# EasyEDA Pro project pcb.epro

# Schematic Schematic1
Board Name: Board1; Create Date: 2026-03-26; Page Name: P1; Project Name: SPEAKER; Schematic Name: Schematic1; Update Date: 2026-03-26; Company: EasyEDA.com; Page Size: A4; Version: V1.0
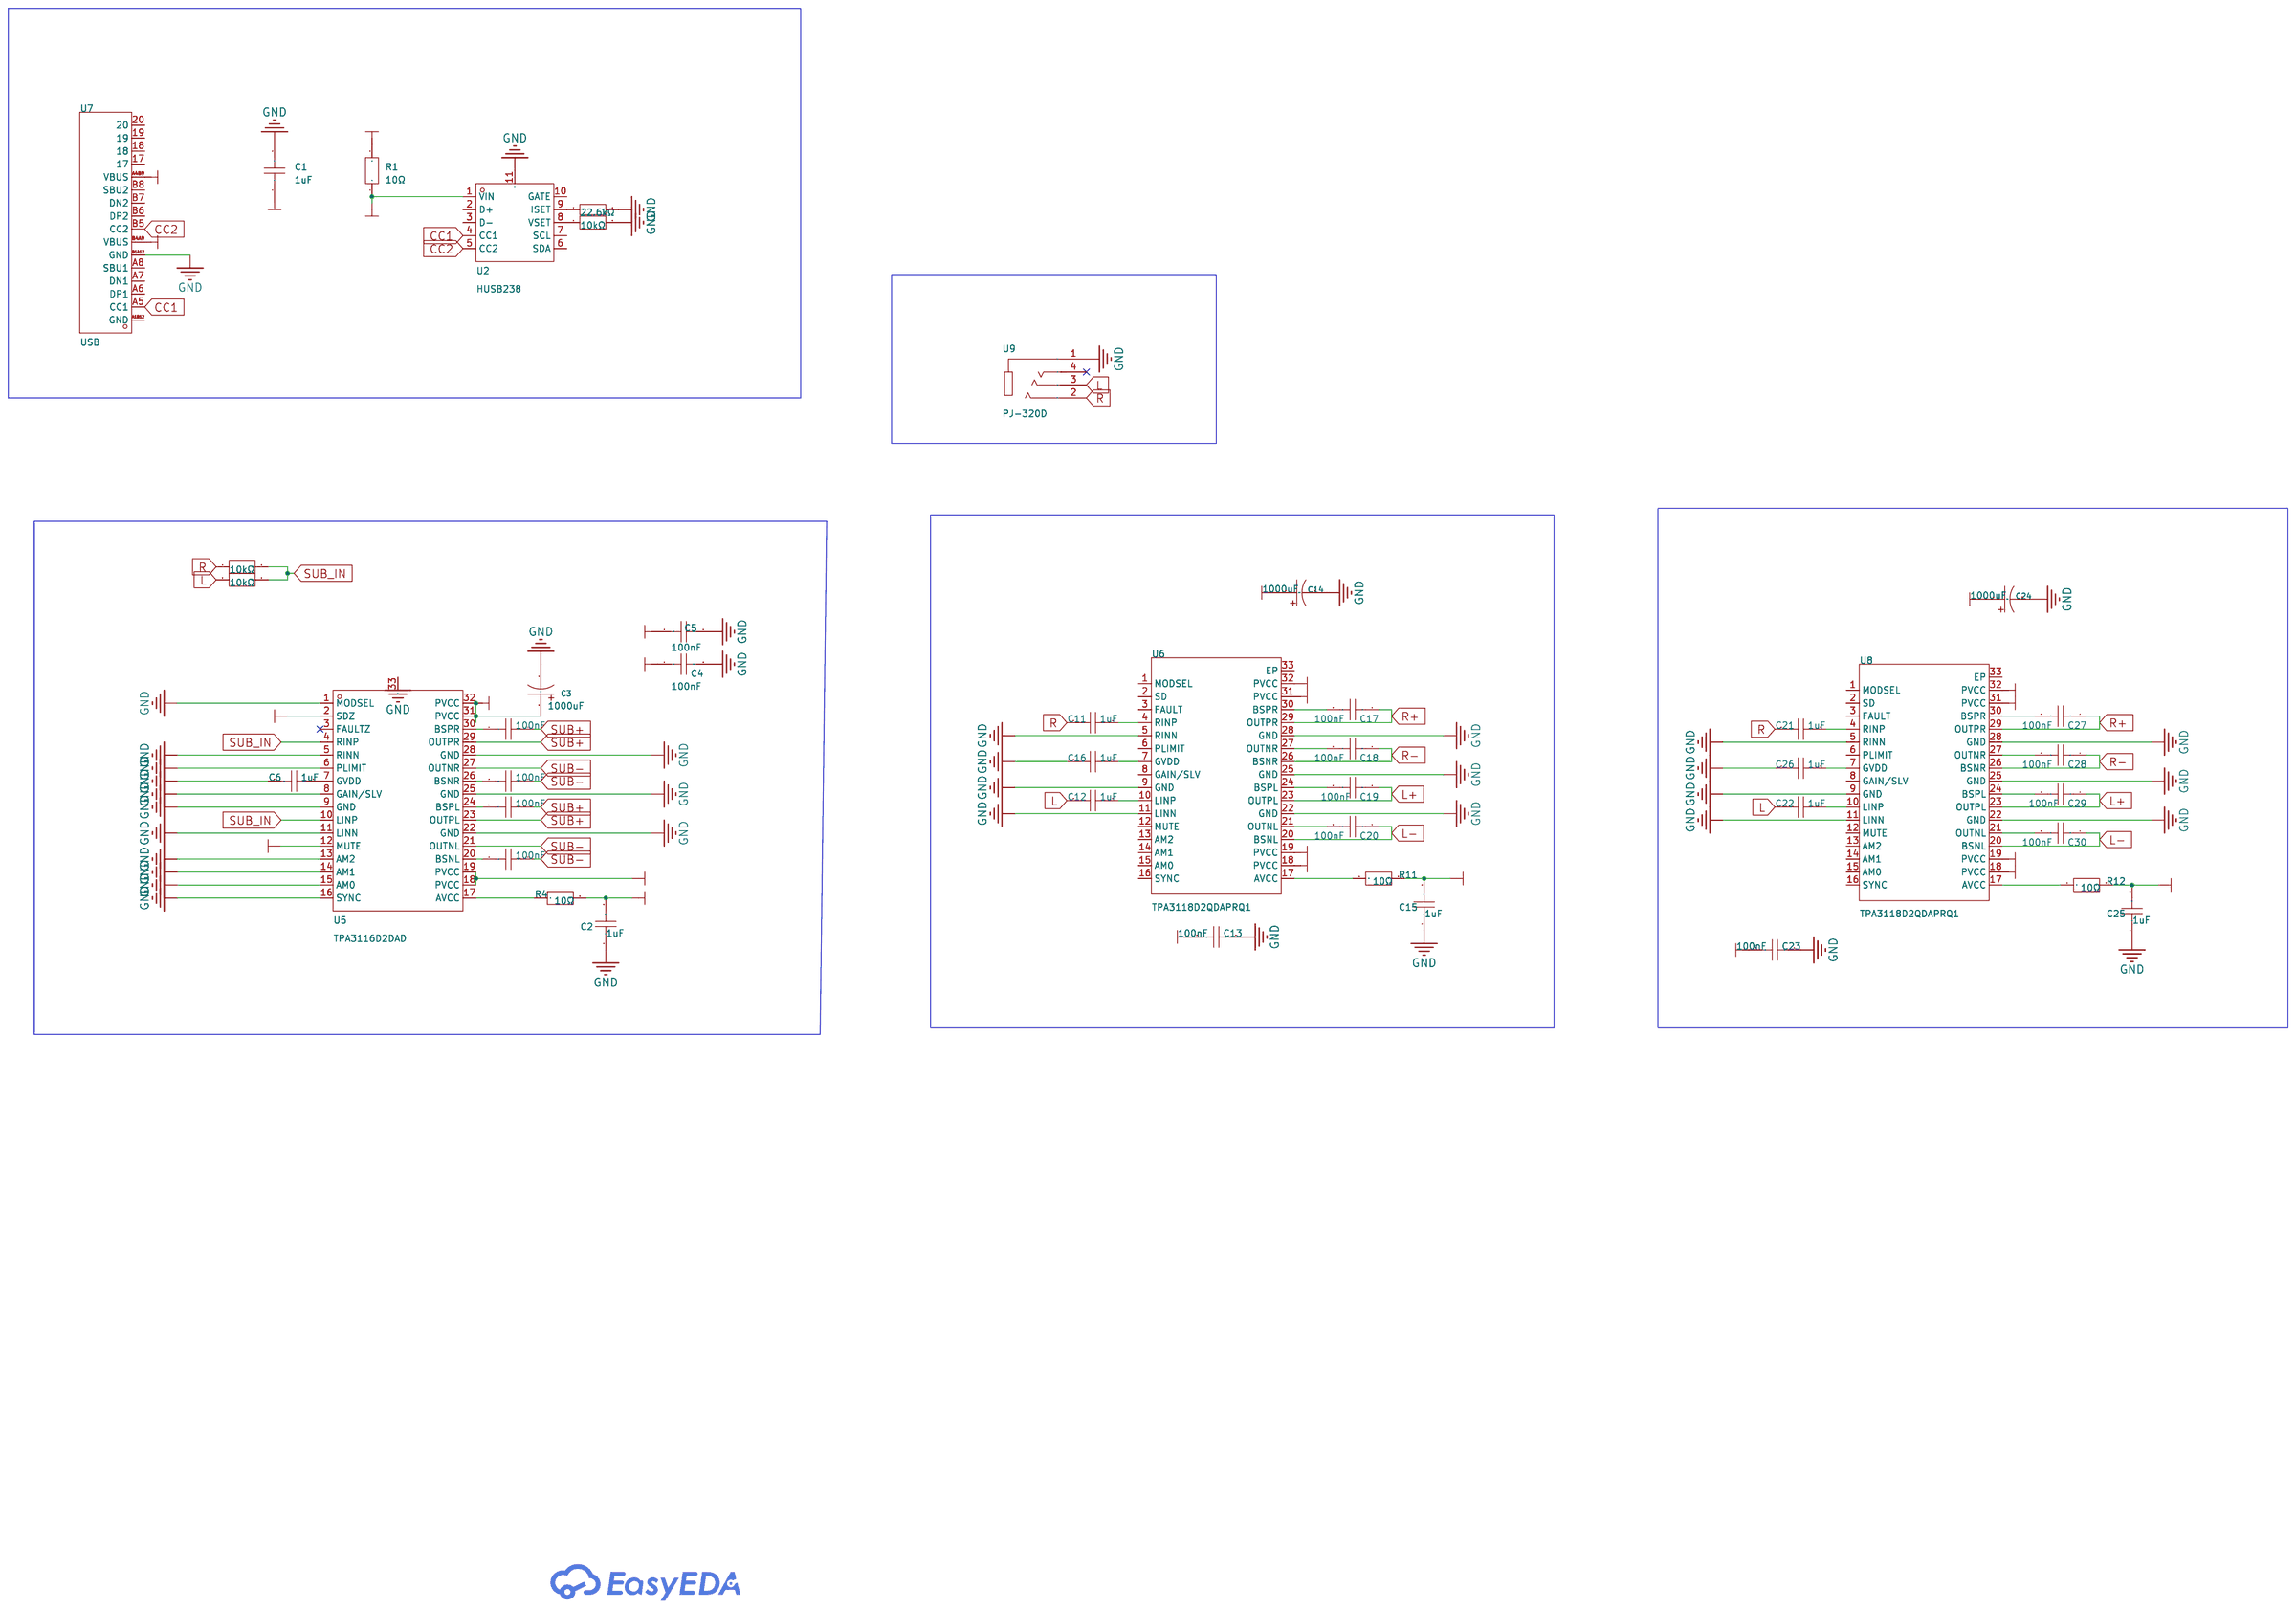
[diagram p0: schematic sheet]

## Parts
C1  1uF  [C0805]
C2  1uF  [C0805]
C3  1000uF  [CAP-TH_BD12.5-P5.00-D0.6-FD]
C4  100nF  [C0603]
C5  100nF  [C0603]
C6  1uF  [C0805]
C7  100nF  [C0603]
C8  100nF  [C0603]
C9  100nF  [C0603]
C10  100nF  [C0603]
C11  1uF  [C0805]
C12  1uF  [C0805]
C13  100nF  [C0603]
C14  1000uF  [CAP-TH_BD12.5-P5.00-D0.6-FD]
C15  1uF  [C0805]
C16  1uF  [C0805]
C17  100nF  [C0603]
C18  100nF  [C0603]
C19  100nF  [C0603]
C20  100nF  [C0603]
C21  1uF  [C0805]
C22  1uF  [C0805]
C23  100nF  [C0603]
C24  1000uF  [CAP-TH_BD12.5-P5.00-D0.6-FD]
C25  1uF  [C0805]
C26  1uF  [C0805]
C27  100nF  [C0603]
C28  100nF  [C0603]
C29  100nF  [C0603]
C30  100nF  [C0603]
R1  10Ω  [R0805]
R2  10kΩ  [R0805]
R3  22.6kΩ  [R0805]
R4  10Ω  [R0805]
R9  10kΩ  [R0805]
R10  10kΩ  [R0805]
R11  10Ω  [R0805]
R12  10Ω  [R0805]
U2  HUSB238  [TDFN-10_L3.0-W3.0-P0.50-TL-EP]
U5  TPA3116D2DAD  [HTSSOP-32_L11.0-W6.1-P0.65-LS8.1-BL]
U6  TPA3118D2QDAPRQ1  [HTSSOP-32_L11.0-W6.1-P0.65-LS8.1-EP3.5_TPA3118D2QDAPRQ1]
U7  USB  [USB-SMD_TYPE-C16PIN-1]
U8  TPA3118D2QDAPRQ1  [HTSSOP-32_L11.0-W6.1-P0.65-LS8.1-EP3.5_TPA3118D2QDAPRQ1]
U9  PJ-320D  [AUDIO-SMD_HANELECTRICITY_PJ-320D]

## Library data of the parts
C1 C2 C6 C11 C12 C15 C16 C21 C22 C25 C26 = LMK212BJ105KG-T: Capacitance: Tolerance:±10% Tolerance:±10% Voltage Rating: Temperature Coefficient:; LCSC Part Name: 1uF ±10% 10V; Supplier Part: C3878898; Manufacturer: TAIYO YUDEN(太诱); Supplier Footprint: 0805; JLCPCB Part Class: Extended Part; Datasheet: https://atta.szlcsc.com/upload/public/pdf/source/20210525/C2802164_C0429B055888A674C3F00BA74B841C5B.pdf; Supplier: LCSC; Tolerance: ±10%
C3 C14 C24 = ECR1HBK102MLL125025: Capacitance:1000uF Tolerance:±20% Tolerance:±20% Voltage Rating:50V Pin Spacing:5mm Diameter:- Height - Seated (Max):- Lifetime:2000hrs@105℃; LCSC Part Name: 1000uF ±20% 50V; Supplier Part: C233103; Manufacturer: Jianghai(南通江海); Supplier Footprint: 插件; JLCPCB Part Class: Extended Part; Supplier: LCSC; Tolerance: ±20%; Voltage Rating: 50V; Pin Spacing: 5mm; Lifetime: 2000hrs@105℃
C4 C5 C7-C10 C13 C17-C20 C23 C27-C30 = CC0603KRX7R9BB104: Capacitance:100nF Tolerance:±10% Tolerance:±10% Voltage Rating:50V Temperature Coefficient:X7R; LCSC Part Name: 100nF ±10% 50V; Supplier Part: C14663; Manufacturer: YAGEO(国巨); Supplier Footprint: 0603; JLCPCB Part Class: Basic Part; Datasheet: https://item.szlcsc.com/datasheet/CC0603KRX7R9BB104/15331.html; Supplier: LCSC; Tolerance: ±10%; Voltage Rating: 50V; Temperature Coefficient: X7R
R1 R4 R11 R12 = MMV05F10R0E: Resistance:10Ω Tolerance:±1% Tolerance:±1% Power(Watts):125mW Temperature Coefficient:±100ppm/℃ Temperature Coefficient:±100ppm/℃ Operating Temperature:-55℃~+155℃ Operating Temperature:-55℃~+155℃; LCSC Part Name: 10Ω ±1% 125mW; Supplier Part: C5675088; Manufacturer: Ohmite; Supplier Footprint: 0805; JLCPCB Part Class: Extended Part; Supplier: LCSC; Tolerance: ±1%; Power(Watts): 125mW; Temperature Coefficient: ±100ppm/℃; Operating Temperature: -55℃~+155℃
R2 R9 R10 = RK73H2ATTE1002F: Resistance:10kΩ Tolerance:±1% Tolerance:±1%; LCSC Part Name: 10kΩ ±1%; Supplier Part: C7050396; Manufacturer: KOA; Supplier Footprint: 0805; JLCPCB Part Class: Extended Part; Datasheet: https://atta.szlcsc.com/upload/public/pdf/source/20240311/4A4D64C25C05C7F668F1C9BDA7CA7852.pdf; Supplier: LCSC; Tolerance: ±1%
R3 = 0805W8F2262T5E: Type:Thick Film Resistors Resistance:22600Ω Tolerance:±1% Tolerance:±1% Power(Watts): Overload Voltage (Max): Operating Temperature Range:-55℃~+155℃ Operating Temperature Range:-55℃~+155℃; LCSC Part Name: 22.6kΩ ±1% 125mW 厚膜电阻; Supplier Part: C17554; Supplier Footprint: 0805; JLCPCB Part Class: Extended Part; Supplier: LCSC; Type: Thick Film Resistors; Tolerance: ±1%; Operating Temperature Range: -55℃~+155℃
U2 = HUSB238: Supplier Part: C9900042462; Supplier Footprint: DFN-10L; Supplier: LCSC
U5 = TPA3116D2DAD: Class:Class D Speaker Channels:2-Channel Output Power:50W×2@4Ω Total Harmonic Distortion + Noise (THD+N):0.1% Quiescent Current:35mA Signal-to-Noise Ratio:102dB Power Supply Rejection Ratio (PSRR):-70dB Efficiency:90% Number of Inputs:- Features:Filterles; LCSC Part Name: 具有AM抑制功能的15W、30W、50W无滤波器D类立体声放大器系列; Supplier Part: C2865736; Manufacturer: TI(德州仪器); Supplier Footprint: HTSSOP-32-EP-6.1mm; JLCPCB Part Class: Extended Part; Datasheet: https://www.ti.com/cn/lit/gpn/tpa3118d2; Supplier: LCSC; Class: Class D; Speaker Channels: 2-Channel; Output Power: 50W×2@4Ω; Total Harmonic Distortion + Noise (THD+N): 0.1%; Quiescent Current: 35mA; Signal-to-Noise Ratio: 102dB; Power Supply Rejection Ratio (PSRR): -70dB; Efficiency: 90%; Features: Filterless architecture；Integrated PLL；Overvoltage protection；Configurable output topology; Voltage - Supply: 4.5V~26V; Operating Temperature: -40℃~+85℃
U6 U8 = TPA3118D2QDAPRQ1: Class:Class D Speaker Channels:2-Channel Output Power:30Wx2@8Ω Total Harmonic Distortion + Noise (THD+N):- Quiescent Current:20mA Signal-to-Noise Ratio:102dB Power Supply Rejection Ratio (PSRR):-70dB Efficiency:- Number of Inputs:- Features:- Voltage - Su; Supplier Part: C2863787; Manufacturer: TI(德州仪器); Supplier Footprint: HTSSOP-32-EP-6.1mm; JLCPCB Part Class: Extended Part; Datasheet: https://www.ti.com/cn/lit/gpn/tpa3118d2-q1; Supplier: LCSC; Class: Class D; Speaker Channels: 2-Channel; Output Power: 30Wx2@8Ω; Quiescent Current: 20mA; Signal-to-Noise Ratio: 102dB; Power Supply Rejection Ratio (PSRR): -70dB; Voltage - Supply: 4.5V~26V; Operating Temperature: -40℃~+125℃
U7 = USB_C_Receptacle_HRO_TYPE-C-31-M-12: Supplier Part: C9900015525; Supplier Footprint: USB_C_Receptacle_USB2.0; JLCPCB Part Class: Extended Part; Supplier: LCSC
U9 = PJ-320D_C22459515: Connector Type:3.5mm Headphone Jack Current Rating:500mA Voltage Rating (Max):30V Contact Material:Copper; LCSC Part Name: 3.5mm耳机座; Supplier Part: C22459515; Manufacturer: HanElectricity(瀚源); Supplier Footprint: SMD; JLCPCB Part Class: Extended Part; Datasheet: https://item.szlcsc.com/datasheet/PJ-320D/24136171.html; Supplier: LCSC; Connector Type: 3.5mm Headphone Jack; Current Rating: 500mA; Voltage Rating (Max): 30V; Contact Material: Copper

## Nets
+12V: C2.2 C3.1 C4.2 C5.2 C13.2 C14.1 C15.2 C23.2 C24.1 C25.2 R1.2 R4.2 R11.2 R12.2 U5.2(SDZ) U5.12(MUTE) U5.18(PVCC) U5.19(PVCC) U5.31(PVCC) U5.32(PVCC) U6.18(PVCC) U6.19(PVCC) U6.31(PVCC) U6.32(PVCC) U8.18(PVCC) U8.19(PVCC) U8.31(PVCC) U8.32(PVCC)
GND: C1.2 C2.1 C3.2 C4.1 C5.1 C6.2 C13.1 C14.2 C15.1 C16.2 C23.1 C24.2 C25.1 C26.2 R2.2 R3.2 U2.11(GND) U5.1(MODSEL) U5.5(RINN) U5.6(PLIMIT) U5.8(GAIN/SLV) U5.9(GND) U5.11(LINN) U5.13(AM2) U5.14(AM1) U5.15(AM0) U5.16(SYNC) U5.22(GND) U5.25(GND) U5.28(GND) U5.33(PAD) U6.5(RINN) U6.9(GND) U6.11(LINN) U6.22(GND) U6.25(GND) U6.28(GND) U7.B1A12(GND) U8.5(RINN) U8.9(GND) U8.11(LINN) U8.22(GND) U8.25(GND) U8.28(GND) U9.1
VBUS: C1.1 R1.1 U2.1(VIN) U7.A4B9(VBUS) U7.B4A9(VBUS)
CC1: U2.4(CC1) U7.A5(CC1)
CC2: U2.5(CC2) U7.B5(CC2)
L: C12.2 C22.2 R10.1 U9.3
L+: C19.1 C29.1 U6.23(OUTPL) U8.23(OUTPL)
L-: C20.1 C30.1 U6.20(BSNL) U8.20(BSNL)
R: C11.2 C21.2 R9.1 U9.2
R+: C17.1 C27.1 U6.29(OUTPR) U8.29(OUTPR)
R-: C18.1 C28.1 U6.26(BSNR) U8.26(BSNR)
SUB+: C7.1 C9.1 U5.23(OUTPL) U5.29(OUTPR)
SUB-: C8.1 C10.1 U5.21(OUTNL) U5.27(OUTNR)
SUB_IN: R9.2 R10.2 U5.4(RINP) U5.10(LINP)
$1N1848: R2.1 U2.8(VSET)
$1N1943: R3.1 U2.9(ISET)
$1N2422: R4.1 U5.17(AVCC)
$1N3643: C6.1 U5.7(GVDD)
$1N3809: C7.2 U5.24(BSPL)
$1N3845: C8.2 U5.20(BSNL)
$1N3957: C9.2 U5.30(BSPR)
$1N4055: C10.2 U5.26(BSNR)
$1N5216: C11.1 U6.4(RINP)
$1N5252: C12.1 U6.10(LINP)
$1N5479: R11.1 U6.17(AVCC)
$1N5517: C16.1 U6.7(GVDD)
$1N5606: C17.2 U6.30(BSPR)
$1N5647: C18.2 U6.27(OUTNR)
$1N5688: C19.2 U6.24(BSPL)
$1N5729: C20.2 U6.21(OUTNL)
$1N6687: C29.2 U8.24(BSPL)
$1N6694: C28.2 U8.27(OUTNR)
$1N6696: C27.2 U8.30(BSPR)
$1N6722: C21.1 U8.4(RINP)
$1N6724: C22.1 U8.10(LINP)
$1N6726: C26.1 U8.7(GVDD)
$1N6739: C30.2 U8.21(OUTNL)
$1N6741: R12.1 U8.17(AVCC)

Not connected (* = marked no-connect by the designer): U2 2(D+) 3(D-) 6(SDA) 7(SCL) 10(GATE); U5 3(FAULTZ)*; U6 1(MODSEL) 2(SD) 3(FAULT) 6(PLIMIT) 8(GAIN/SLV) 12(MUTE) 13(AM2) 14(AM1) 15(AM0) 16(SYNC) 33(EP); U7 17 18 19 20 A1B12(GND) A6(DP1) A7(DN1) A8(SBU1) B6(DP2) B7(DN2) B8(SBU2); U8 1(MODSEL) 2(SD) 3(FAULT) 6(PLIMIT) 8(GAIN/SLV) 12(MUTE) 13(AM2) 14(AM1) 15(AM0) 16(SYNC) 33(EP); U9 4*

# Board PCB1
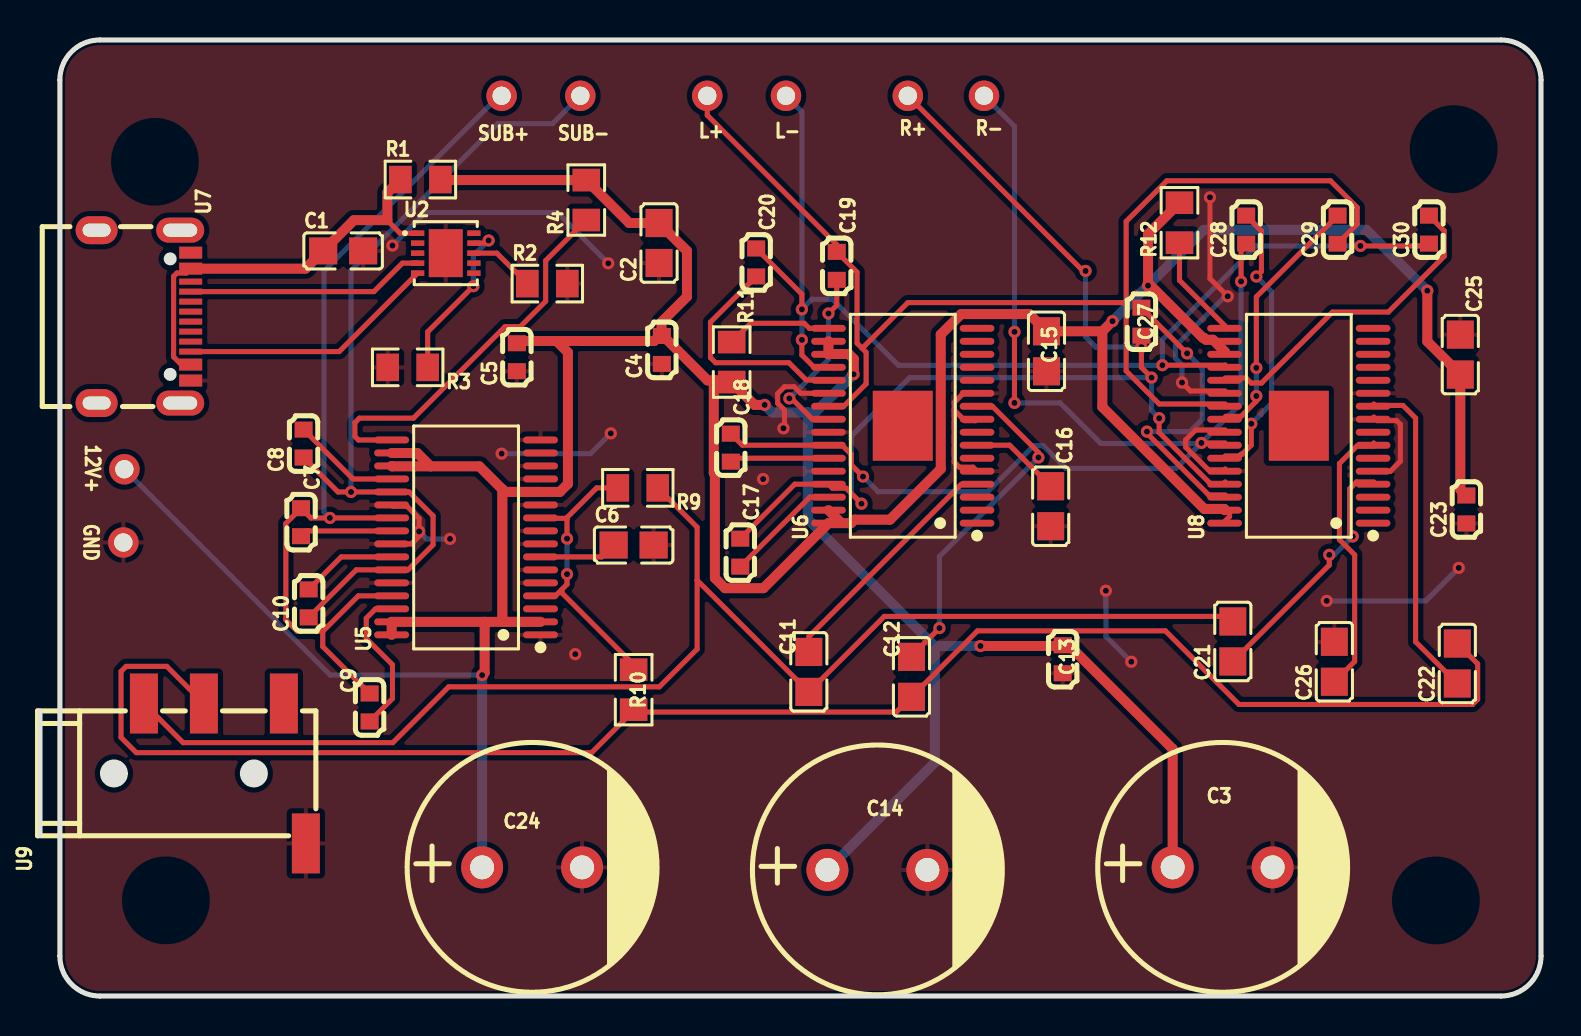
[diagram p1: board, top side]
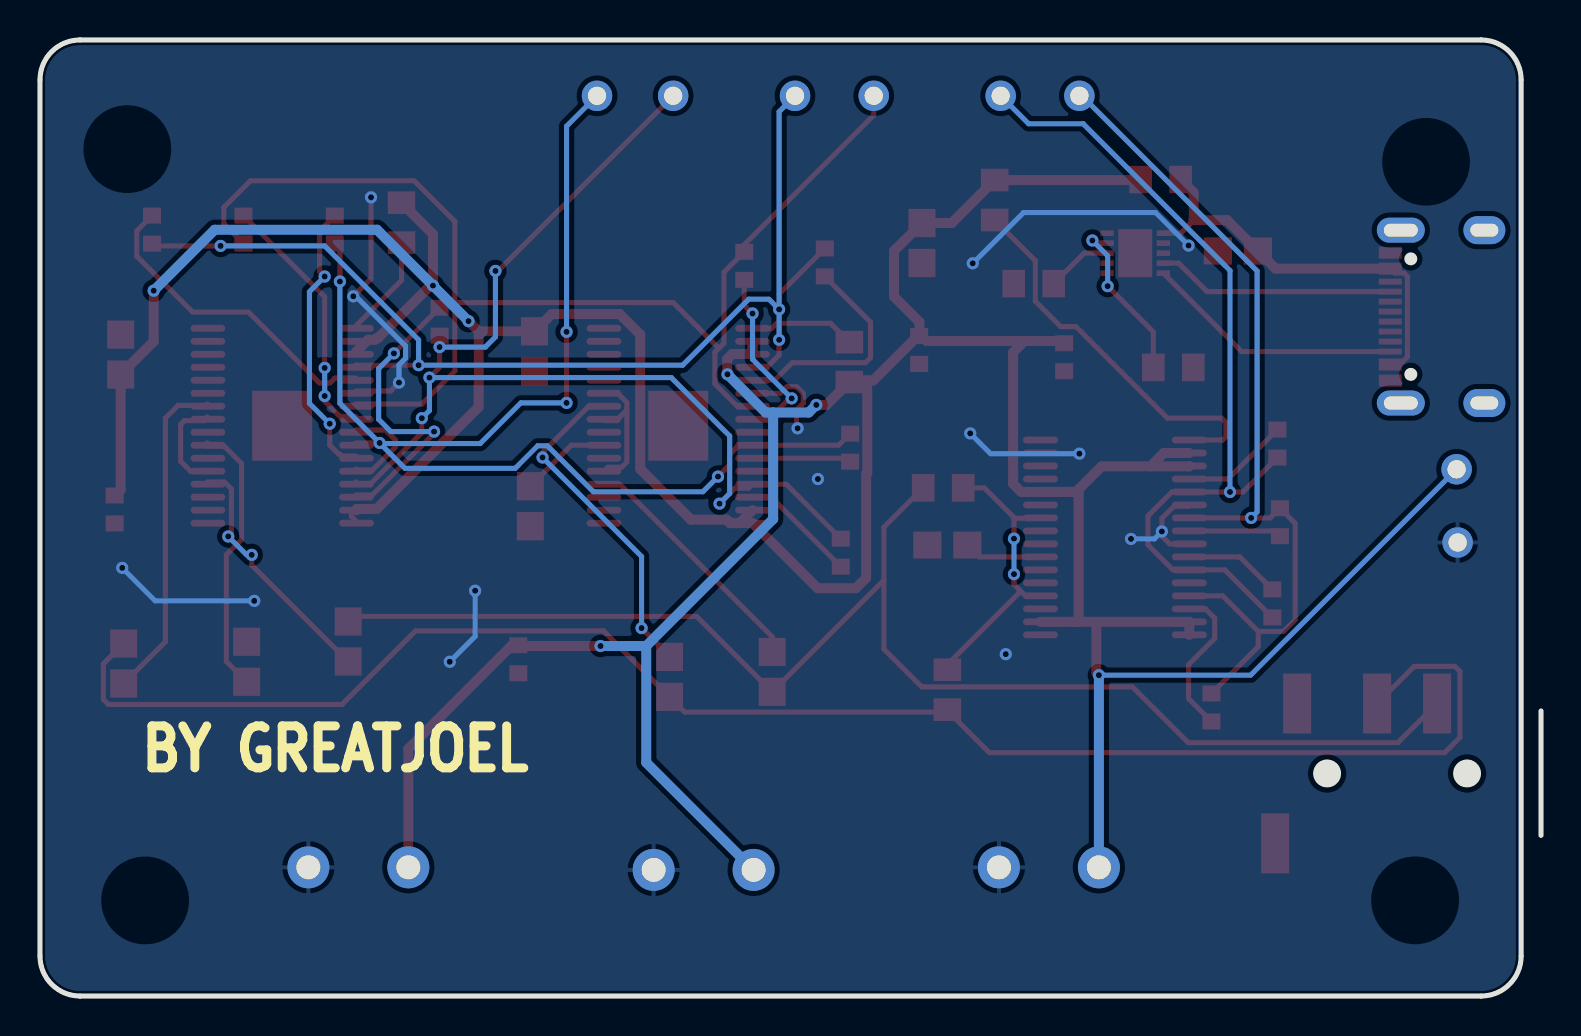
[diagram p2: board, bottom side, seen from below]

Outline 75.09 x 47.84 mm; copper layers: Top Layer, Bottom Layer. Coordinates in mm from the lower left corner of the outline.
Outline path: 1,45.84 1,2 arc(1.58,0.59) 3,0 73.09,0 arc(74.5,0.59) 75.09,2 75.09,45.84 arc(74.5,47.26) 73.09,47.84 3,47.84 arc(1.58,47.26) 1,45.84
Stack: Top Layer 0.035mm / Dielectric1 1.51mm FR4 er 4.5 / Bottom Layer 0.035mm

## Design rules (mm)
template: JLCPCB Capability(Two Layers Board)
spacing copperThickness1oz (default): track to track 0.102, other pairs 0.152 to 0.3
spacing copperThickness2oz: track to track 0.203, other pairs 0.152 to 0.3
track width copperThickness1oz (default): min 0.127, default 0.254, max 2.54
track width copperThickness2oz: min 0.203, default 0.254, max 2.54
differential pair differentialPair (default): width min 0.127, default 0.254, max 2.54; gap min 0.152, default 0.152
via viaSize (default): diameter min 0.5, default 0.61, max 10; hole min 0.3, default 0.305, max 6.3

## Placement (name value [footprint] x y rotation side)
C1  1uF  [C0805]  15.17 37.28 0 top
C2  1uF  [C0805]  30.97 37.68 90 top
C3  1000uF  [CAP-TH_BD12.5-P5.00-D0.6-FD]  59.16 6.44 0 top
C4  100nF  [C0603]  31.11 32.33 90 top
C5  100nF  [C0603]  23.86 31.97 90 top
C6  1uF  [C0805]  29.7 22.57 0 top
C7  100nF  [C0603]  13.06 23.71 270 top
C8  100nF  [C0603]  13.19 27.64 90 top
C9  100nF  [C0603]  16.49 14.44 270 top
C10  100nF  [C0603]  13.44 19.65 90 top
C11  1uF  [C0805]  38.46 16.22 270 top
C12  1uF  [C0805]  43.6 15.97 270 top
C13  100nF  [C0603]  51.16 16.85 90 top
C14  1000uF  [CAP-TH_BD12.5-P5.00-D0.6-FD]  41.89 6.31 0 top
C15  1uF  [C0805]  50.35 32.26 90 top
C16  1uF  [C0805]  50.56 24.51 270 top
C17  100nF  [C0603]  35.03 22.19 270 top
C18  100nF  [C0603]  34.56 27.44 270 top
C19  100nF  [C0603]  39.86 36.54 270 top
C20  100nF  [C0603]  35.83 36.71 270 top
C21  1uF  [C0805]  59.67 17.74 90 top
C22  1uF  [C0805]  70.9 16.64 90 top
C23  100nF  [C0603]  71.35 24.35 90 top
C24  1000uF  [CAP-TH_BD12.5-P5.00-D0.6-FD]  24.62 6.44 0 top
C25  1uF  [C0805]  71.05 32.1 270 top
C26  1uF  [C0805]  64.75 16.73 90 top
C27  100nF  [C0603]  55.1 33.74 90 top
C28  100nF  [C0603]  60.34 38.35 90 top
C29  100nF  [C0603]  64.91 38.35 90 top
C30  100nF  [C0603]  69.48 38.35 90 top
NOREF  -  [Pad_e899]  33.38 45.05 0 top
NOREF#2  -  [Pad_e901]  43.41 45.05 0 top
NOREF#3  -  [Pad_e1148]  4.22 26.36 0 top
NOREF#4  -  [Pad_e902]  47.22 45.05 0 top
NOREF#5  -  [Pad_e898]  27.03 45.05 0 top
NOREF#6  -  [Pad_e897]  23.09 45.05 0 top
NOREF#7  -  [Pad_e900]  37.32 45.05 0 top
NOREF#8  -  [Pad_e1149]  4.17 22.69 0 top
R1  10Ω  [R0805]  19.03 40.86 0 top
R2  10kΩ  [R0805]  25.38 35.65 0 top
R3  22.6kΩ  [R0805]  18.39 31.46 180 top
R4  10Ω  [R0805]  27.33 39.83 90 top
R9  10kΩ  [R0805]  29.9 25.43 180 top
R10  10kΩ  [R0805]  29.7 15.33 90 top
R11  10Ω  [R0805]  34.6 31.72 270 top
R12  10Ω  [R0805]  57 38.7 90 top
U2  HUSB238  [TDFN-10_L3.0-W3.0-P0.50-TL-EP]  20.3 37.17 0 top
U5  TPA3116D2DAD  [HTSSOP-32_L11.0-W6.1-P0.65-LS8.1-BL]  21.32 22.95 90 top
U6  TPA3118D2QDAPRQ1  [HTSSOP-32_L11.0-W6.1-P0.65-LS8.1-EP3.5_TPA3118D2QDAPRQ1]  43.16 28.54 90 top
U7  USB  [USB-SMD_TYPE-C16PIN-1]  5.19 34 270 top
U8  TPA3118D2QDAPRQ1  [HTSSOP-32_L11.0-W6.1-P0.65-LS8.1-EP3.5_TPA3118D2QDAPRQ1]  62.97 28.54 90 top
U9  PJ-320D  [AUDIO-SMD_HANELECTRICITY_PJ-320D]  9.25 11.14 90 top

## Footprints (pads in the part's own frame, mm; a bottom-side part is the same pattern mirrored in y, then rotated)
AUDIO-SMD_HANELECTRICITY_PJ-320D
  rect 3x1.4 smd: 1(-3.5,-4.05) 2(3.5,4.05) 3(3.5,1.05) 4(3.5,-2.95)
C0603
  rect 0.8x0.9 smd: 1(-0.7,0) 2(0.7,0)
C0805
  rect 1.41x1.35 smd: 1(-1,0) 2(1,0)
CAP-TH_BD12.5-P5.00-D0.6-FD
  round 2.1 hole 1.2: 1(-2.5,0) 2(2.5,0)
HTSSOP-32_L11.0-W6.1-P0.65-LS8.1-BL
  oval 0.343x1.746 smd: 1(-4.875,-3.724) 2(-4.225,-3.724) 3(-3.575,-3.724) 4(-2.925,-3.724) 5(-2.275,-3.724) 6(-1.625,-3.724) 7(-0.975,-3.724) 8(-0.325,-3.724) 9(0.325,-3.724) 10(0.975,-3.724) 11(1.625,-3.724) 12(2.275,-3.724) 13(2.925,-3.724) 14(3.575,-3.724) 15(4.225,-3.724) 16(4.875,-3.724) 17(4.875,3.724) 18(4.225,3.724) 19(3.575,3.724) 20(2.925,3.724) 21(2.275,3.724) 22(1.625,3.724) 23(0.975,3.724) 24(0.325,3.724) 25(-0.325,3.724) 26(-0.975,3.724) 27(-1.625,3.724) 28(-2.275,3.724) 29(-2.925,3.724) 30(-3.575,3.724) 31(-4.225,3.724) 32(-4.875,3.724)
HTSSOP-32_L11.0-W6.1-P0.65-LS8.1-EP3.5_TPA3118D2QDAPRQ1
  oval 0.343x1.732 smd: 1(-4.875,-3.716) 2(-4.225,-3.716) 3(-3.575,-3.716) 4(-2.925,-3.716) 5(-2.275,-3.716) 6(-1.625,-3.716) 7(-0.975,-3.716) 8(-0.325,-3.716) 9(0.325,-3.716) 10(0.975,-3.716) 11(1.625,-3.716) 12(2.275,-3.716) 13(2.925,-3.716) 14(3.575,-3.716) 15(4.225,-3.716) 16(4.875,-3.716) 17(4.875,3.716) 18(4.225,3.716) 19(3.575,3.716) 20(2.925,3.716) 21(2.275,3.716) 22(1.625,3.716) 23(0.975,3.716) 24(0.325,3.716) 25(-0.325,3.716) 26(-0.975,3.716) 27(-1.625,3.716) 28(-2.275,3.716) 29(-2.925,3.716) 30(-3.575,3.716) 31(-4.225,3.716) 32(-4.875,3.716)
  rect 3.5x3 smd: 33(0,0)
Pad_e897
  round 1.524 hole 0.914: 1(0,0)
Pad_e898
  round 1.524 hole 0.914: 1(0,0)
Pad_e899
  round 1.524 hole 0.914: 1(0,0)
Pad_e900
  round 1.524 hole 0.914: 1(0,0)
Pad_e901
  round 1.524 hole 0.914: 1(0,0)
Pad_e902
  round 1.524 hole 0.914: 1(0,0)
Pad_e1148
  round 1.524 hole 0.914: 1(0,0)
Pad_e1149
  round 1.524 hole 0.914: 2(0,0)
R0805
  rect 1.133x1.377 smd: 1(-1,0) 2(1,0)
TDFN-10_L3.0-W3.0-P0.50-TL-EP
  rect 0.665x0.28 smd: 1(-1.407,1) 2(-1.407,0.5) 3(-1.407,0) 4(-1.407,-0.5) 5(-1.407,-1) 6(1.407,-1) 7(1.407,-0.5) 8(1.407,0) 9(1.407,0.5) 10(1.407,1)
  rect 1.7x2.4 smd: 11(0,0)
USB-SMD_TYPE-C16PIN-1
  oval 1.25x2.4 hole 0.65x1.7: 17(-4.325,1.827) 18(4.325,1.827)
  oval 1.4x2.1 hole 0.65x1.4: 19(-4.325,-2.353) 20(4.325,-2.353)
  rect 0.6x1.15 smd: A1B12(-3.2,2.353) A4B9(-2.4,2.353) B1A12(3.2,2.353) B4A9(2.4,2.353)
  rect 0.3x1.15 smd: A5(-1.25,2.353) A6(-0.25,2.353) A7(0.25,2.353) A8(1.25,2.353) B5(1.75,2.353) B6(0.75,2.353) B7(-0.75,2.353) B8(-1.75,2.353)

## Nets
+12V: C2.2 C3.1 C4.2 C5.2 C13.2 C14.1 C15.2 C23.2 C24.1 C25.2 NOREF#3.1 R1.2 R4.2 R11.2 R12.2 U5.2 U5.12 U5.18 U5.19 U5.31 U5.32 U6.18 U6.19 U6.31 U6.32 U8.18 U8.19 U8.31 U8.32
GND: C1.2 C2.1 C3.2 C4.1 C5.1 C6.2 C13.1 C14.2 C15.1 C16.2 C23.1 C24.2 C25.1 C26.2 NOREF#8.2 R2.2 R3.2 U2.11 U5.1 U5.5 U5.6 U5.8 U5.9 U5.11 U5.13 U5.14 U5.15 U5.16 U5.22 U5.25 U5.28 U6.5 U6.9 U6.11 U6.22 U6.25 U6.28 U7.B1A12 U8.5 U8.9 U8.11 U8.22 U8.25 U8.28 U9.1
VBUS: C1.1 R1.1 U2.1 U7.A4B9 U7.B4A9
CC1: U2.4 U7.A5
CC2: U2.5 U7.B5
L: C12.2 C22.2 R10.1 U9.3
L+: C19.1 C29.1 NOREF.1 U6.23 U8.23
L-: C20.1 C30.1 NOREF#7.1 U6.20 U8.20
R: C11.2 C21.2 R9.1 U9.2
R+: C17.1 C27.1 NOREF#2.1 U6.29 U8.29
R-: C18.1 C28.1 NOREF#4.1 U6.26 U8.26
SUB+: C7.1 C9.1 NOREF#6.1 U5.23 U5.29
SUB-: C8.1 C10.1 NOREF#5.1 U5.21 U5.27
SUB_IN: R9.2 R10.2 U5.4 U5.10
$1N1848: R2.1 U2.8
$1N1943: R3.1 U2.9
$1N2422: R4.1 U5.17
$1N3643: C6.1 U5.7
$1N3809: C7.2 U5.24
$1N3845: C8.2 U5.20
$1N3957: C9.2 U5.30
$1N4055: C10.2 U5.26
$1N5216: C11.1 U6.4
$1N5252: C12.1 U6.10
$1N5479: R11.1 U6.17
$1N5517: C16.1 U6.7
$1N5606: C17.2 U6.30
$1N5647: C18.2 U6.27
$1N5688: C19.2 U6.24
$1N5729: C20.2 U6.21
$1N6687: C29.2 U8.24
$1N6694: C28.2 U8.27
$1N6696: C27.2 U8.30
$1N6722: C21.1 U8.4
$1N6724: C22.1 U8.10
$1N6726: C26.1 U8.7
$1N6739: C30.2 U8.21
$1N6741: R12.1 U8.17

Pads without a net: U2 2 3 6 7 10; U5 3; U6 1 2 3 6 8 12 13 14 15 16 33; U7 17 18 19 20 A1B12 A6 A7 A8 B6 B7 B8; U8 1 2 3 6 8 12 13 14 15 16 33; U9 4

## Via types
v1: diameter 0.61, hole 0.305, Top Layer to Bottom Layer, 55 vias

## Routing (per net, layer and track width the routed paths; a pad name or vN(x,y) marks a point on that pad's centre or on a via; arc(x,y) is an arc through that point)
+12V: length 250.7
  Top Layer w0.254: 59.33,24.43 59.51,24.25 59.51,23.99 59.29,23.78
  Top Layer w0.5: 23.13,25.36 21.98,26.5 19.54,26.5 ; 22.24,18.72 22.24,16.18 v1(22.12,16.06) ; 22.24,18.72 23.26,18.72 ; 22.24,18.72 U5.31 U5.32 ; 53.14,33.26 v1(53.65,33.77) ; 53.14,33.26 53.14,29.47 58.24,24.37 59.24,24.37 59.26,24.36 59.26,24.31 ; 53.14,33.26 C15.2 49.49,34.12 46.08,34.12 45.06,33.1 45.06,26.38 42.52,23.84 40.74,23.84 40.62,23.71 ; C5.2 23.97,32.78 25.84,32.78 ; R1.2 20.05,40.83 R4.2 29.48,38.68 C2.2 32.36,37.28 32.36,35 31.09,33.73 31.09,33.11 33.4,30.81 33.76,30.81 ; 25.84,32.78 30.73,32.78 30.98,33.03 ; 25.84,32.78 26.41,32.21 26.41,25.63 26,25.22 U5.12 ; v1(47.05,17.52) 51.11,17.52 ; 51.11,17.52 51.51,17.52 56.66,12.37 C3.1 ; 51.11,17.52 C13.2 ; v1(36.25,29.58) 35.74,29.58 R11.2 34.52,30.81 33.76,30.81 ; R12.2 55.43,38.12 v1(55.43,35.55) 55.56,35.55 58.17,32.94 58.22,32.94 58.32,32.84 58.68,32.84 59.29,32.23 ; U5.19 17.61,26.5 19.54,26.5 ; 19.54,26.5 18.87,27.17 U5.18 ; 33.76,30.81 33.7,30.75 33.7,26.17 33.76,26.12 33.76,20.92 34.27,20.41 36.19,20.41 U6.32 40.57,23.66 40.62,23.71 ; C23.2 71.05,25.35 71.05,31.1 69.4,32.75 v1(69.4,35.29) ; 40.62,23.71 40.57,23.71 ; U6.18 U6.19 39.46,32.13 40.46,32.13 40.71,31.87 40.71,31.13 v1(40.7,31.11) ; U6.31 39.99,23.77
  Top Layer w0.508: U5.12 23.26,25.22 23.13,25.36 23.13,18.86 23.26,18.72 U5.2
  Bottom Layer w0.254: v1(22.12,16.06) 14.53,16.06 NOREF#3.1
  Bottom Layer w0.5: 38.41,29.2 36.63,29.2 v1(36.25,29.58) ; 38.41,29.2 38.78,29.2 v1(40.7,31.11) ; 38.41,29.2 38.41,23.86 44.76,17.52 ; 44.76,17.52 44.76,11.68 C14.1 ; 44.76,17.52 v1(47.05,17.52) ; v1(22.12,16.06) C24.1 ; v1(53.65,33.77) v1(55.43,35.55) 58.22,38.34 66.35,38.34 v1(69.4,35.29)
GND: length 70.5
  Top Layer w0.254: U5.25 18.58,22.62 18.97,23.01 18.97,23.9 18.36,24.51 17.66,24.51 U5.22 ; U6.11 46.19,30.16 45.73,29.7 45.73,29.33 ; 45.73,29.33 45.73,26.73 45.99,26.46 46.68,26.46 U6.5 ; 45.73,29.33 46.26,28.79 46.8,28.79 U6.9 ; v1(58.53,39.97) 58.53,35.9 v1(59.42,35.01) ; U6.22 38.06,30.16 37.73,30.49 37.24,30.49 36.9,30.15 36.9,29.66 37.24,29.32 37.24,28.46 v1(37.19,28.41) ; v1(57.13,30.7) 57.55,30.28 59.29,30.28 ; 59.29,28.33 57.81,28.33 57.31,27.83 57.31,27.47 58.45,26.33 59.24,26.33 59.29,26.38 ; 66.72,28.98 66.91,28.79 67.87,28.79 68.05,28.61 68.05,26.76 67.54,26.25 66.72,26.25 66.71,26.26 U8.5
  Bottom Layer w0.254: v1(59.42,35.01) 59.29,35.01 56.8,32.52 56.8,31.92 57.13,31.59 v1(57.13,30.7) ; v1(18.97,23.25) 19.34,22.88 v1(20.51,22.88) ; v1(64.37,19.77) 69.32,19.77 v1(70.97,21.42) ; v1(28.55,28.16) 27.54,27.14 v1(23.09,27.14) ; v1(53.32,20.28) 53.32,18 v1(54.59,16.73) ; v1(28.43,36.66) 25.89,39.2 19.28,39.2 v1(17.63,37.55)
  vias: v1(26.78,17.11) v1(36.17,25.87)
VBUS: length 21.1
  Top Layer w0.254: U7.A4B9 7.32,36.18 6.85,36.18 6.68,36.01 6.68,31.98 7.21,31.46 7.4,31.46 U7.B4A9 ; U2.1 18.01,38.17 17.38,38.81
  Top Layer w0.5: U7.A4B9 13.28,36.4 C1.1 15.7,38.82 17.38,38.82 17.38,40.2 18.03,40.86
CC1: length 11.9
  Top Layer w0.254: U2.4 18.13,36.67 16.7,35.25 U7.A5
CC2: length 13
  Top Layer w0.254: U7.B5 14.97,32.25 U2.5
L: length 84.5
  Top Layer w0.254: 29.88,14.46 27.59,12.18 4.82,12.18 4.06,12.94 4.06,16.24 4.31,16.5 6.34,16.5 U9.3 ; 29.88,14.46 29.73,14.43 29.7,14.58 ; 29.88,14.46 29.88,14.21 42.83,14.21 C12.2 46.9,18.27 56.3,18.27 59.98,14.59 71.66,14.59 71.92,14.84 71.92,16.62 C22.2
L+: length 62.5
  Top Layer w0.254: 41.13,32.41 40.87,32.67 40.87,36.22 C19.1 39.86,37.6 33.38,44.07 NOREF.1 ; 41.13,32.41 43.41,34.7 54.33,34.7 ; 41.13,32.41 41.33,32.21 41.33,30.63 40.2,29.51 39.44,29.51 ; 54.33,34.7 54.33,31.28 55.99,29.63 59.29,29.63 ; 54.33,34.7 54.33,38.76 56.37,40.79 64.56,40.79 65.89,39.46 65.89,38.63 C29.1
L-: length 58.2
  Top Layer w0.254: 59.29,31.58 59.28,31.57 v1(56.15,31.57) ; U6.20 38.73,31.46 38.11,32.07 v1(38.11,32.84) ; v1(66.05,37.53) 69.37,37.53 C30.1 ; C20.1 38.11,35.12 v1(38.11,34.36)
  Bottom Layer w0.254: v1(66.05,37.53) 60.85,37.53 56.15,32.84 v1(56.15,31.57) 42.94,31.57 39.64,34.87 38.62,34.87 v1(38.11,34.36) ; NOREF#7.1 38.11,44.25 v1(38.11,34.36) ; v1(38.11,34.36) v1(38.11,32.84)
R: length 70.1
  Top Layer w0.254: 32.87,20.81 32.87,17.36 30.98,15.47 20.44,15.47 17.65,12.68 7.16,12.68 U9.2 ; 32.87,20.81 C11.2 42.24,19 59.42,19 C21.2 ; 32.87,20.81 32.87,23.46 R9.1
R+: length 55.9
  Top Layer w0.254: C17.1 37.76,25.61 U6.29 39.64,25.41 40.32,25.41 41.09,24.64 v1(41.09,24.64) ; C27.1 v1(55.1,32.47) 55.1,31.45 v1(55.61,30.95) ; 59.29,25.73 59.18,25.62 58.57,25.62 55.99,28.2 v1(55.99,28.91) ; v1(52.3,36.28) 52.18,36.28 NOREF#2.1
  Bottom Layer w0.254: v1(52.3,36.28) 52.3,32.98 52.81,32.47 v1(55.1,32.47) ; v1(55.99,28.91) 55.61,29.29 v1(55.61,30.95) 43.51,30.95 40.59,28.02 40.59,25.15 v1(41.09,24.64)
R-: length 65.3
  Top Layer w0.254: v1(58.1,27.68) 59.29,27.68 ; C18.1 35.14,27.56 U6.26 40.12,27.56 40.59,27.1 40.59,26.57 v1(41.17,25.99) ; C28.1 60.08,37.4 v1(60.08,35.76) ; v1(48.75,29.68) v1(48.75,33.24)
  Bottom Layer w0.254: v1(41.17,25.99) 41.93,25.23 47.41,25.23 49.7,27.53 50.19,27.53 51.32,26.41 56.83,26.41 58.07,27.65 ; 58.07,27.65 53.07,27.65 51.03,29.68 v1(48.75,29.68) ; 58.07,27.65 v1(58.1,27.68) 60.08,29.66 v1(60.08,35.76) ; v1(48.75,33.24) 48.75,43.52 NOREF#4.1
SUB+: length 46
  Top Layer w0.254: C9.1 14.14,17.48 14.14,18.25 ; U5.29 15.92,20.02 14.14,18.25 ; 14.14,18.25 12.88,18.25 12.3,18.82 12.3,23.65 C7.1 13.55,23.92 v1(14.5,23.92) U5.23
  Bottom Layer w0.254: NOREF#6.1 22.97,45.05 14.2,36.28 14.2,24.22 v1(14.5,23.92)
SUB-: length 43
  Top Layer w0.254: C8.1 14.91,25.22 v1(15.56,25.22) U5.21 18.46,25.22 19.66,24.02 19.66,22.58 18.41,21.32 U5.27 15.82,21.32 C10.1
  Bottom Layer w0.254: NOREF#5.1 25.63,43.65 22.9,43.65 15.56,36.31 v1(15.56,25.22)
SUB_IN: length 14.6
  Top Layer w0.254: U5.4 25.79,20.02 26.11,20.35 ; 29.7,16.58 26.11,20.17 26.11,20.35 ; 26.36,23.9 26.36,23.94 27.85,25.43 R9.2 ; 26.36,23.9 25.06,23.9 U5.10 ; 26.36,23.9 v1(26.36,22.89) ; 26.11,20.35 26.36,20.6 v1(26.36,21.11)
  Bottom Layer w0.254: v1(26.36,22.89) v1(26.36,21.11)
$1N1848: length 3.3
  Top Layer w0.254: R2.1 22.86,37.17 U2.8
$1N1943: length 8.4
  Top Layer w0.254: U2.9 22.31,37.67 v1(22.44,37.81) ; v1(21.68,35.52) 19.39,33.24 R3.1
  Bottom Layer w0.254: v1(21.68,35.52) 21.68,37.05 v1(22.44,37.81)
$1N2422: length 19.6
  Top Layer w0.254: R4.1 25.3,36.8 25.3,34.77 24.03,33.5 23.26,33.5 18.69,28.92 15.98,28.92 15.75,28.69 15.75,28 15.93,27.82 U5.17
$1N3643: length 3.9
  Top Layer w0.254: 25.04,21.97 28.1,21.97 C6.1
$1N3809: length 4.6
  Top Layer w0.254: U5.24 13.32,23.27 C7.2
$1N3845: length 5.4
  Top Layer w0.254: C8.2 15.66,25.87 U5.20
$1N3957: length 7.6
  Top Layer w0.254: C9.2 17.63,14.88 17.63,16.58 16.32,17.89 16.32,18.91 16.79,19.37 U5.30
$1N4055: length 4.8
  Top Layer w0.254: 17.59,21.97 15.07,21.97 C10.2
$1N5216: length 12.3
  Top Layer w0.254: C11.1 38.46,17.98 46.08,25.6 46.86,25.6 U6.4
$1N5252: length 16.9
  Top Layer w0.254: v1(49.95,26.95) 49.95,27.2 47.66,29.49 46.9,29.49 46.88,29.51 ; v1(44.99,18.41) 43.6,17.02 C12.1
  Bottom Layer w0.254: v1(49.95,26.95) 44.99,22 v1(44.99,18.41)
$1N5479: length 5.3
  Top Layer w0.254: R11.1 35.54,33.67 38.23,33.67 38.48,33.41 U6.17
$1N5517: length 4.5
  Top Layer w0.254: U6.7 48.51,27.56 C16.1
$1N5606: length 5.9
  Top Layer w0.254: C17.2 38.51,24.96 U6.30
$1N5647: length 5
  Top Layer w0.254: C18.2 34.73,26.91 U6.27
$1N5688: length 9.3
  Top Layer w0.254: v1(37.49,29.91) 37.6,29.91 38.64,28.86 U6.24 ; v1(39.44,34.15) 39.86,34.57 C19.2
  Bottom Layer w0.254: v1(39.44,34.15) 39.44,31.86 v1(37.49,29.91)
$1N5729: length 11.4
  Top Layer w0.254: C20.2 33.54,33.72 33.54,31.94 33.8,31.69 37.46,31.69 38.33,30.82 39.43,30.82 U6.21
$1N6687: length 12.9
  Top Layer w0.254: v1(60.85,30.02) 60.85,29.77 60.08,29.01 59.32,29.01 59.29,28.98 ; C29.2 60.85,34.99 v1(60.85,31.43)
  Bottom Layer w0.254: v1(60.85,31.43) v1(60.85,30.02)
$1N6694: length 14.2
  Top Layer w0.254: 59.29,27.03 60,27.03 60.08,27.11 60.14,27.11 60.59,27.57 v1(60.59,28.64) ; v1(60.85,36) 61.1,36.26 61.1,38.29 C28.2
  Bottom Layer w0.254: v1(60.59,28.64) 61.61,29.65 61.61,35.24 v1(60.85,36)
$1N6696: length 15.2
  Top Layer w0.254: 59.29,25.08 58.46,25.08 55.37,28.16 v1(55.37,28.24) ; C27.2 v1(57.38,32.16)
  Bottom Layer w0.254: v1(55.37,28.24) 57.53,28.24 58.14,28.86 58.14,31.4 v1(57.38,32.16)
$1N6722: length 12.7
  Top Layer w0.254: v1(64.49,22.08) 64.49,21.57 C21.1 ; 66.72,25.73 65.86,25.73 65.51,25.38 65.51,23.16 v1(65.67,23)
  Bottom Layer w0.254: v1(64.49,22.08) 64.75,22.08 v1(65.67,23)
$1N6724: length 16.5
  Top Layer w0.254: 66.72,29.63 66.79,29.55 68.18,29.55 68.81,28.92 68.81,17.73 C22.1
$1N6726: length 13.9
  Top Layer w0.254: C26.1 65.77,16.74 65.77,22.08 65,22.84 65,26.65 65.88,27.52 66.72,27.52 66.72,27.68
$1N6739: length 16
  Top Layer w0.254: C30.2 70.24,38.29 70.24,37.02 67.45,34.23 64.66,34.23 61.1,30.67 60.59,30.67 60.34,30.93 59.29,30.93
$1N6741: length 5.1
  Top Layer w0.254: R12.1 57,35.81 59.29,33.53

## Copper pours and planes (outline as drawn; the poured copper is in the pictures)
GND on Top Layer: -10.05,52.03 85.96,52.03 85.96,-3.85 -10.05,-3.85
GND on Bottom Layer: -12.85,53.3 89.77,53.3 89.77,-6.01 -12.85,-6.01

## Text on the board
Bottom Silkscreen Layer: BY GREATJOEL
Top Silkscreen Layer: SUB+ | SUB- | L+ | L- | R+ | R- | GND | 12V+
